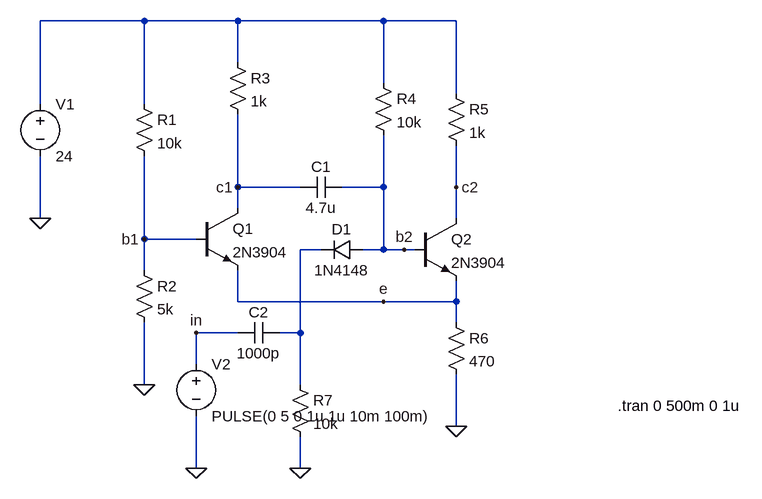
[diagram p0: schematic monostable.asc]
monostable.asc, the LTspice schematic file:
Version 4
SHEET 1 880 680
WIRE -224 -160 -384 -160
WIRE -80 -160 -224 -160
WIRE 144 -160 -80 -160
WIRE 256 -160 144 -160
WIRE -80 -96 -80 -160
WIRE 144 -64 144 -160
WIRE 256 -48 256 -160
WIRE -384 -32 -384 -160
WIRE -224 -32 -224 -160
WIRE -80 96 -80 -16
WIRE 16 96 -80 96
WIRE 144 96 144 16
WIRE 144 96 80 96
WIRE 256 96 256 32
WIRE -80 128 -80 96
WIRE -384 144 -384 48
WIRE 256 144 256 96
WIRE -224 176 -224 48
WIRE -144 176 -224 176
WIRE 48 192 16 192
WIRE 144 192 144 96
WIRE 144 192 112 192
WIRE 176 192 144 192
WIRE 192 192 176 192
WIRE -224 224 -224 176
WIRE -80 272 -80 224
WIRE 144 272 -80 272
WIRE 256 272 256 240
WIRE 256 272 144 272
WIRE 256 304 256 272
WIRE -80 320 -144 320
WIRE 16 320 16 192
WIRE 16 320 -16 320
WIRE -144 368 -144 320
WIRE -224 400 -224 304
WIRE 16 400 16 320
WIRE 256 464 256 384
WIRE -144 528 -144 448
WIRE 16 528 16 480
FLAG 256 464 0
FLAG -224 400 0
FLAG -384 144 0
FLAG -144 528 0
FLAG 16 528 0
FLAG -224 176 b1
FLAG -80 96 c1
FLAG 144 272 e
FLAG 176 192 b2
FLAG 256 96 c2
FLAG -144 320 in
SYMBOL res -240 -48 R0
SYMATTR InstName R1
SYMATTR Value 10k
SYMBOL res -240 208 R0
SYMATTR InstName R2
SYMATTR Value 5k
SYMBOL npn -144 128 R0
SYMATTR InstName Q1
SYMATTR Value 2N3904
SYMBOL res -96 -112 R0
SYMATTR InstName R3
SYMATTR Value 1k
SYMBOL npn 192 144 R0
SYMATTR InstName Q2
SYMATTR Value 2N3904
SYMBOL cap 80 80 R90
WINDOW 0 0 32 VBottom 2
WINDOW 3 32 32 VTop 2
SYMATTR InstName C1
SYMATTR Value 4.7u
SYMBOL res 128 -80 R0
SYMATTR InstName R4
SYMATTR Value 10k
SYMBOL res 240 -64 R0
SYMATTR InstName R5
SYMATTR Value 1k
SYMBOL res 240 288 R0
SYMATTR InstName R6
SYMATTR Value 470
SYMBOL voltage -384 -48 R0
WINDOW 123 0 0 Left 2
WINDOW 39 0 0 Left 2
SYMATTR InstName V1
SYMATTR Value 24
SYMBOL voltage -144 352 R0
WINDOW 123 0 0 Left 2
WINDOW 39 0 0 Left 2
SYMATTR InstName V2
SYMATTR Value PULSE(0 5 0 1u 1u 10m 100m)
SYMBOL cap -16 304 R90
WINDOW 0 0 32 VBottom 2
WINDOW 3 32 32 VTop 2
SYMATTR InstName C2
SYMATTR Value 1000p
SYMBOL res 0 384 R0
SYMATTR InstName R7
SYMATTR Value 10k
SYMBOL diode 112 176 R90
WINDOW 0 0 32 VBottom 2
WINDOW 3 32 32 VTop 2
SYMATTR InstName D1
SYMATTR Value 1N4148
TEXT 504 432 Left 2 !.tran 0 500m 0 1u

The netlist it stands for:
* monostable.asc
R1 N001 b1 10k
R2 b1 0 5k
Q1 c1 b1 e 0 2N3904
R3 N001 c1 1k
Q2 c2 b2 e 0 2N3904
C1 b2 c1 4.7u
R4 N001 b2 10k
R5 N001 c2 1k
R6 e 0 470
V1 N001 0 24
V2 in 0 PULSE(0 5 0 1u 1u 10m 100m)
C2 N002 in 1000p
R7 N002 0 10k
D1 b2 N002 1N4148
.model D D
.lib standard.dio
.model NPN NPN
.model PNP PNP
.lib standard.bjt
.tran 0 500m 0 1u
.backanno
.end